# Altium schematic sheet Decode.SchDoc
size B; Author: E. Sims; Organization: Let's Build Rockets Inc.; SheetNumber: 3; SheetTotal: 5
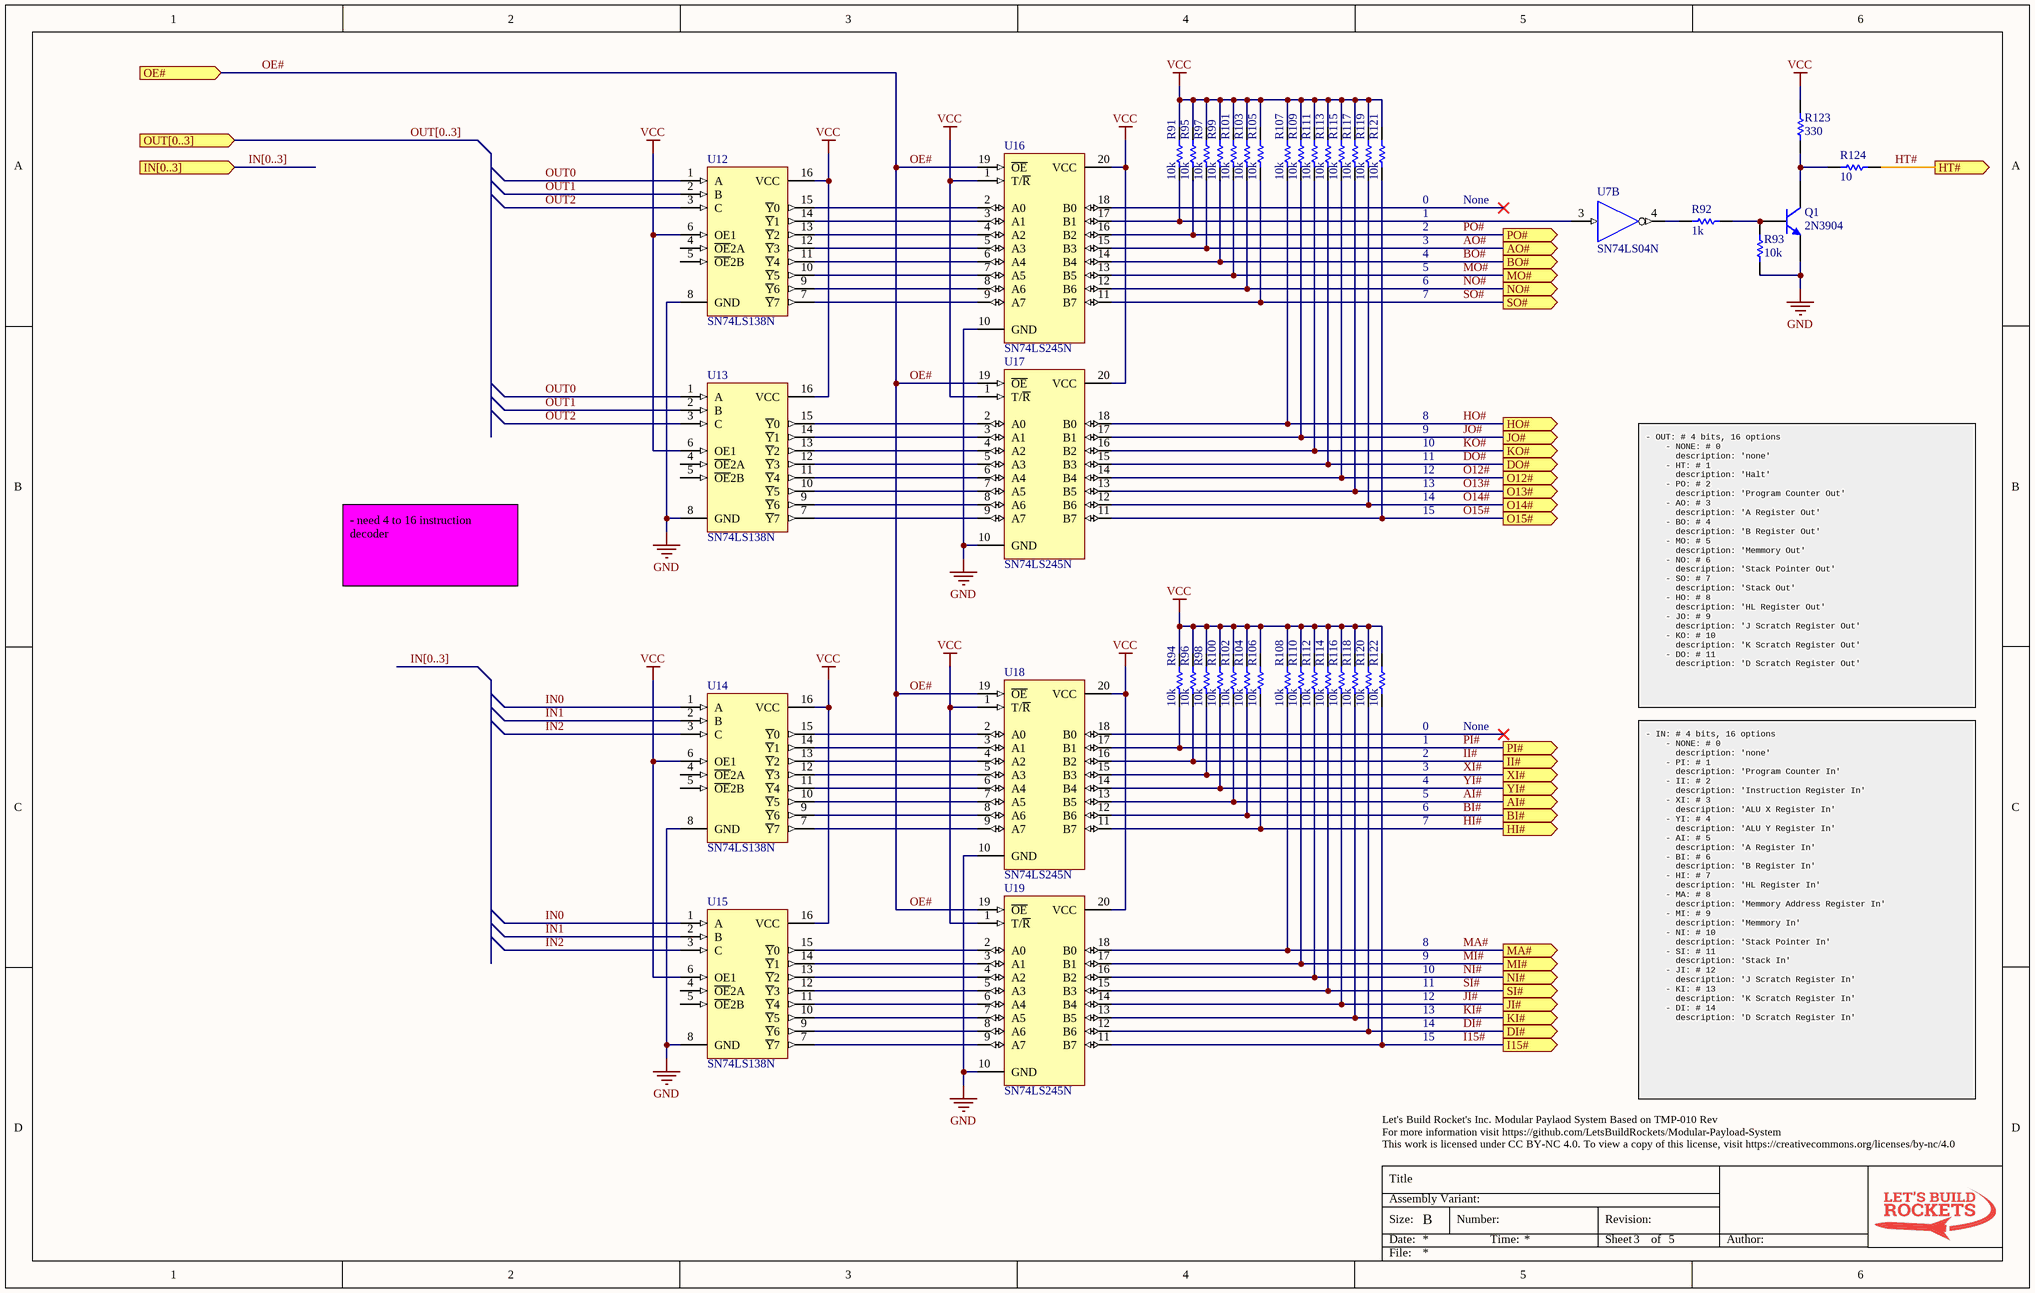
[diagram p0: Decode.SchDoc]

## Parts
Q1  2N3904  [TO-92A]
R91  value 10k  [AXIAL-0.3]  (hidden comment: Res1)
R92  value 1k  [AXIAL-0.3]  (hidden comment: Res1)
R93  value 10k  [AXIAL-0.3]  (hidden comment: Res1)
R94  value 10k  [AXIAL-0.3]  (hidden comment: Res1)
R95  value 10k  [AXIAL-0.3]  (hidden comment: Res1)
R96  value 10k  [AXIAL-0.3]  (hidden comment: Res1)
R97  value 10k  [AXIAL-0.3]  (hidden comment: Res1)
R98  value 10k  [AXIAL-0.3]  (hidden comment: Res1)
R99  value 10k  [AXIAL-0.3]  (hidden comment: Res1)
R100  value 10k  [AXIAL-0.3]  (hidden comment: Res1)
R101  value 10k  [AXIAL-0.3]  (hidden comment: Res1)
R102  value 10k  [AXIAL-0.3]  (hidden comment: Res1)
R103  value 10k  [AXIAL-0.3]  (hidden comment: Res1)
R104  value 10k  [AXIAL-0.3]  (hidden comment: Res1)
R105  value 10k  [AXIAL-0.3]  (hidden comment: Res1)
R106  value 10k  [AXIAL-0.3]  (hidden comment: Res1)
R107  value 10k  [AXIAL-0.3]  (hidden comment: Res1)
R108  value 10k  [AXIAL-0.3]  (hidden comment: Res1)
R109  value 10k  [AXIAL-0.3]  (hidden comment: Res1)
R110  value 10k  [AXIAL-0.3]  (hidden comment: Res1)
R111  value 10k  [AXIAL-0.3]  (hidden comment: Res1)
R112  value 10k  [AXIAL-0.3]  (hidden comment: Res1)
R113  value 10k  [AXIAL-0.3]  (hidden comment: Res1)
R114  value 10k  [AXIAL-0.3]  (hidden comment: Res1)
R115  value 10k  [AXIAL-0.3]  (hidden comment: Res1)
R116  value 10k  [AXIAL-0.3]  (hidden comment: Res1)
R117  value 10k  [AXIAL-0.3]  (hidden comment: Res1)
R118  value 10k  [AXIAL-0.3]  (hidden comment: Res1)
R119  value 10k  [AXIAL-0.3]  (hidden comment: Res1)
R120  value 10k  [AXIAL-0.3]  (hidden comment: Res1)
R121  value 10k  [AXIAL-0.3]  (hidden comment: Res1)
R122  value 10k  [AXIAL-0.3]  (hidden comment: Res1)
R123  value 330  [AXIAL-0.3]  (hidden comment: Res1)
R124  value 10  [AXIAL-0.3]  (hidden comment: Res1)
U7  SN74LS04N  [N014]  (part B of 6)
U12  SN74LS138N  [N016]
U13  SN74LS138N  [N016]
U14  SN74LS138N  [N016]
U15  SN74LS138N  [N016]
U16  SN74LS245N  [N020]
U17  SN74LS245N  [N020]
U18  SN74LS245N  [N020]
U19  SN74LS245N  [N020]

## Ports
AI# (out), AO# (out), BI# (out), BO# (out), DI# (out), DO# (out), HI# (out), HO# (out), HT# (out), I15# (out), II# (out), IN[0..3] (in), JI# (out), JO# (out), KI# (out), KO# (out), MA# (out), MI# (out), MO# (out), NI# (out), NO# (out), O12# (out), O13# (out), O14# (out), O15# (out), OE# (in), OUT[0..3] (in), PI# (out), PO# (out), SI# (out), SO# (out), XI# (out), YI# (out)

## Nets
GND: Q1.1(E) R93.2 U7.7(GND) U12.8(GND) U13.8(GND) U14.8(GND) U15.8(GND) U16.10(GND) U17.10(GND) U18.10(GND) U19.10(GND)
VCC: R91.2 R94.2 R95.2 R96.2 R97.2 R98.2 R99.2 R100.2 R101.2 R102.2 R103.2 R104.2 R105.2 R106.2 R107.2 R108.2 R109.2 R110.2 R111.2 R112.2 R113.2 R114.2 R115.2 R116.2 R117.2 R118.2 R119.2 R120.2 R121.2 R122.2 R123.1 U7.14(VCC) U12.6(OE1) U12.16(VCC) U13.6(OE1) U13.16(VCC) U14.6(OE1) U14.16(VCC) U15.6(OE1) U15.16(VCC) U16.1(T/~{R}) U16.20(VCC) U17.1(T/~{R}) U17.20(VCC) U18.1(T/~{R}) U18.20(VCC) U19.1(T/~{R}) U19.20(VCC)
AI#: R102.1 U18.13(B5) ; port AI#
AO#: R97.1 U16.15(B3) ; port AO#
BI#: R104.1 U18.12(B6) ; port BI#
BO#: R99.1 U16.14(B4) ; port BO#
DI#: R120.1 U19.12(B6) ; port DI#
DO#: R113.1 U17.15(B3) ; port DO#
HI#: R106.1 U18.11(B7) ; port HI#
HO#: R107.1 U17.18(B0) ; port HO#
HT#: R124.1 ; port HT#
I15#: R122.1 U19.11(B7) ; port I15#
II#: R96.1 U18.16(B2) ; port II#
IN0: U14.1(A) U15.1(A)
IN1: U14.2(B) U15.2(B)
IN2: U14.3(C) U15.3(C)
JI#: R116.1 U19.14(B4) ; port JI#
JO#: R109.1 U17.17(B1) ; port JO#
KI#: R118.1 U19.13(B5) ; port KI#
KO#: R111.1 U17.16(B2) ; port KO#
MA#: R108.1 U19.18(B0) ; port MA#
MI#: R110.1 U19.17(B1) ; port MI#
MO#: R101.1 U16.13(B5) ; port MO#
NI#: R112.1 U19.16(B2) ; port NI#
NO#: R103.1 U16.12(B6) ; port NO#
O12#: R115.1 U17.14(B4) ; port O12#
O13#: R117.1 U17.13(B5) ; port O13#
O14#: R119.1 U17.12(B6) ; port O14#
O15#: R121.1 U17.11(B7) ; port O15#
OE#: U16.19(~{OE}) U17.19(~{OE}) U18.19(~{OE}) U19.19(~{OE}) ; port OE#
OUT0: U12.1(A) U13.1(A)
OUT1: U12.2(B) U13.2(B)
OUT2: U12.3(C) U13.3(C)
PI#: R94.1 U18.17(B1) ; port PI#
PO#: R95.1 U16.16(B2) ; port PO#
SI#: R114.1 U19.15(B3) ; port SI#
SO#: R105.1 U16.11(B7) ; port SO#
XI#: R98.1 U18.15(B3) ; port XI#
YI#: R100.1 U18.14(B4) ; port YI#
NetQ1_2: Q1.2(B) R92.1 R93.1
NetQ1_3: Q1.3(C) R123.2 R124.2
NetR91_1: R91.1 U7.3(A) U16.17(B1)
NetR92_2: R92.2 U7.4(Y)
NetU12_7: U12.7(~{Y}7) U16.9(A7)
NetU12_9: U12.9(~{Y}6) U16.8(A6)
NetU12_10: U12.10(~{Y}5) U16.7(A5)
NetU12_11: U12.11(~{Y}4) U16.6(A4)
NetU12_12: U12.12(~{Y}3) U16.5(A3)
NetU12_13: U12.13(~{Y}2) U16.4(A2)
NetU12_14: U12.14(~{Y}1) U16.3(A1)
NetU12_15: U12.15(~{Y}0) U16.2(A0)
NetU13_7: U13.7(~{Y}7) U17.9(A7)
NetU13_9: U13.9(~{Y}6) U17.8(A6)
NetU13_10: U13.10(~{Y}5) U17.7(A5)
NetU13_11: U13.11(~{Y}4) U17.6(A4)
NetU13_12: U13.12(~{Y}3) U17.5(A3)
NetU13_13: U13.13(~{Y}2) U17.4(A2)
NetU13_14: U13.14(~{Y}1) U17.3(A1)
NetU13_15: U13.15(~{Y}0) U17.2(A0)
NetU14_7: U14.7(~{Y}7) U18.9(A7)
NetU14_9: U14.9(~{Y}6) U18.8(A6)
NetU14_10: U14.10(~{Y}5) U18.7(A5)
NetU14_11: U14.11(~{Y}4) U18.6(A4)
NetU14_12: U14.12(~{Y}3) U18.5(A3)
NetU14_13: U14.13(~{Y}2) U18.4(A2)
NetU14_14: U14.14(~{Y}1) U18.3(A1)
NetU14_15: U14.15(~{Y}0) U18.2(A0)
NetU15_7: U15.7(~{Y}7) U19.9(A7)
NetU15_9: U15.9(~{Y}6) U19.8(A6)
NetU15_10: U15.10(~{Y}5) U19.7(A5)
NetU15_11: U15.11(~{Y}4) U19.6(A4)
NetU15_12: U15.12(~{Y}3) U19.5(A3)
NetU15_13: U15.13(~{Y}2) U19.4(A2)
NetU15_14: U15.14(~{Y}1) U19.3(A1)
NetU15_15: U15.15(~{Y}0) U19.2(A0)

Not connected (* = marked no-connect by the designer): U12 4(~{OE}2A) 5(~{OE}2B); U13 4(~{OE}2A) 5(~{OE}2B); U14 4(~{OE}2A) 5(~{OE}2B); U15 4(~{OE}2A) 5(~{OE}2B); U16 18(B0)*; U18 18(B0)*

## Buses and harness runs
bus IN[0..3]
bus IN[0..3] = port IN[0..3]
bus OUT[0..3] = port OUT[0..3]

## Notes on the sheet
- 0
- 1
- 2
- None
- 3
- 4
- 5
- 6
- 7
- 8
- 9
- 10
- 11
- 12
- 13
- 14
- 15
- - need 4 to 16 instruction decoder
- - OUT: # 4 bits, 16 options
  - NONE: # 0
  description: 'none'
  - HT: # 1
  description: 'Halt'
  - PO: # 2
  description: 'Program Counter Out'
  - AO: # 3
  description: 'A Register Out'
  - BO: # 4
  description: 'B Register Out'
  - MO: # 5
  description: 'Memmory Out'
  - NO: # 6
  description: 'Stack Pointer Out'
  - SO: # 7
  description: 'Stack Out'
  - HO: # 8
  description: 'HL Register Out'
  - JO: # 9
  description: 'J Scratch Register Out'
  - KO: # 10
  description: 'K Scratch Register Out'
  - DO: # 11
  description: 'D Scratch Register Out'
- - IN: # 4 bits, 16 options
  - NONE: # 0
  description: 'none'
  - PI: # 1
  description: 'Program Counter In'
  - II: # 2
  description: 'Instruction Register In'
  - XI: # 3
  description: 'ALU X Register In'
  - YI: # 4
  description: 'ALU Y Register In'
  - AI: # 5
  description: 'A Register In'
  - BI: # 6
  description: 'B Register In'
  - HI: # 7
  description: 'HL Register In'
  - MA: # 8
  description: 'Memmory Address Register In'
  - MI: # 9
  description: 'Memmory In'
  - NI: # 10
  description: 'Stack Pointer In'
  - SI: # 11
  description: 'Stack In'
  - JI: # 12
  description: 'J Scratch Register In'
  - KI: # 13
  description: 'K Scratch Register In'
  - DI: # 14
  description: 'D Scratch Register In'
- Let's Build Rocket's Inc. Modular Paylaod System Based on TMP-010 Rev
  For more information visit https://github.com/LetsBuildRockets/Modular-Payload-System
  This work is licensed under CC BY-NC 4.0. To view a copy of this license, visit https://creativecommons.org/licenses/by-nc/4.0
- Title
- Size:
- Date:
- Assembly Variant:
- B
- Number:
- Time:
- Revision:
- Sheet
- of
- Author:
- File:

## Library data of the parts
Q1 = 2N3904: NPN General Purpose Amplifier; Published: 8-Jun-2000; LatestRevisionDate: 15-Jan-2003; LatestRevisionNote: PCB Footprint 'BCY-W3/D4.7' replaced; DatasheetVersion: 1997; PackageVersion: Sep-1998; PackageReference: TO-92A; Publisher: Altium Limited; PackageDescription: TO, Flat Index; 3 In-Line, Axial Leads; Body Dia. 4.5mm; Leads 0.51 x 0.48 mm (max); ComponentLink1Description: Manufacturer Link; ComponentLink1URL: http://www.fairchildsemi.com/; ComponentLink2Description: Datasheet; ComponentLink2URL: http://www.fairchildsemi.com/ds/2N%2F2N3904.pdf
R91-R124 = Res1: Resistor; Published: 8-Jun-2000; LatestRevisionDate: 17-Jul-2002; LatestRevisionNote: Re-released for DXP Platform.; PackageReference: AXIAL-0.3; Publisher: Altium Limited; PackageDescription: Axial Device, Thru-Hole; 2 Leads; 0.3 in Pin Spacing
U7 = SN74LS04N: Hex Inverter; Published: 8-Jun-2000; LatestRevisionDate: 04-Mar-2005; LatestRevisionNote: Stylized 3D Model Added.; DatasheetVersion: Mar-1988; PackageVersion: Oct-1995; PackageReference: N014; Publisher: Altium Limited; PackageDescription: DIP; 14 Leads; Row Spacing 7.62 mm; Pitch 2.54 mm; ComponentLink1Description: Manufacturer Link; ComponentLink1URL: http://www.ti.com/; ComponentLink2Description: Datasheet; ComponentLink2URL: http://www-s.ti.com/sc/ds/sn74ls04.pdf
U12-U15 = SN74LS138N: 3-Line to 8-Line Decoder / Demultiplexer; Published: 8-Jun-2000; LatestRevisionDate: 04-Mar-2005; LatestRevisionNote: Stylized 3D Model Added.; DatasheetVersion: Mar-1988; PackageVersion: Oct-1995; PackageReference: N016; Publisher: Altium Limited; PackageDescription: DIP; 16 Leads; Row Spacing 7.62 mm; Pitch 2.54 mm; Code_JEDEC: MS-001-BB; ComponentLink1Description: Manufacturer Link; ComponentLink1URL: http://www.ti.com/; ComponentLink2Description: Datasheet; ComponentLink2URL: http://www-s.ti.com/sc/ds/sn74ls138.pdf
U16-U19 = SN74LS245N: Octal Bus Transceiver with 3-State Outputs; Published: 8-Jun-2000; LatestRevisionDate: 04-Mar-2005; LatestRevisionNote: Stylized 3D Model Added.; DatasheetVersion: Mar-1988; PackageVersion: Oct-1995; PackageReference: N020; Publisher: Altium Limited; PackageDescription: DIP; 20 Leads; Row Spacing 7.62 mm; Pitch 2.54 mm; ComponentLink1Description: Manufacturer Link; ComponentLink1URL: http://www.ti.com/; ComponentLink2Description: Datasheet; ComponentLink2URL: http://www-s.ti.com/sc/ds/sn74ls245.pdf